# EAGLE design hw6 (EAGLE 9.6.2)
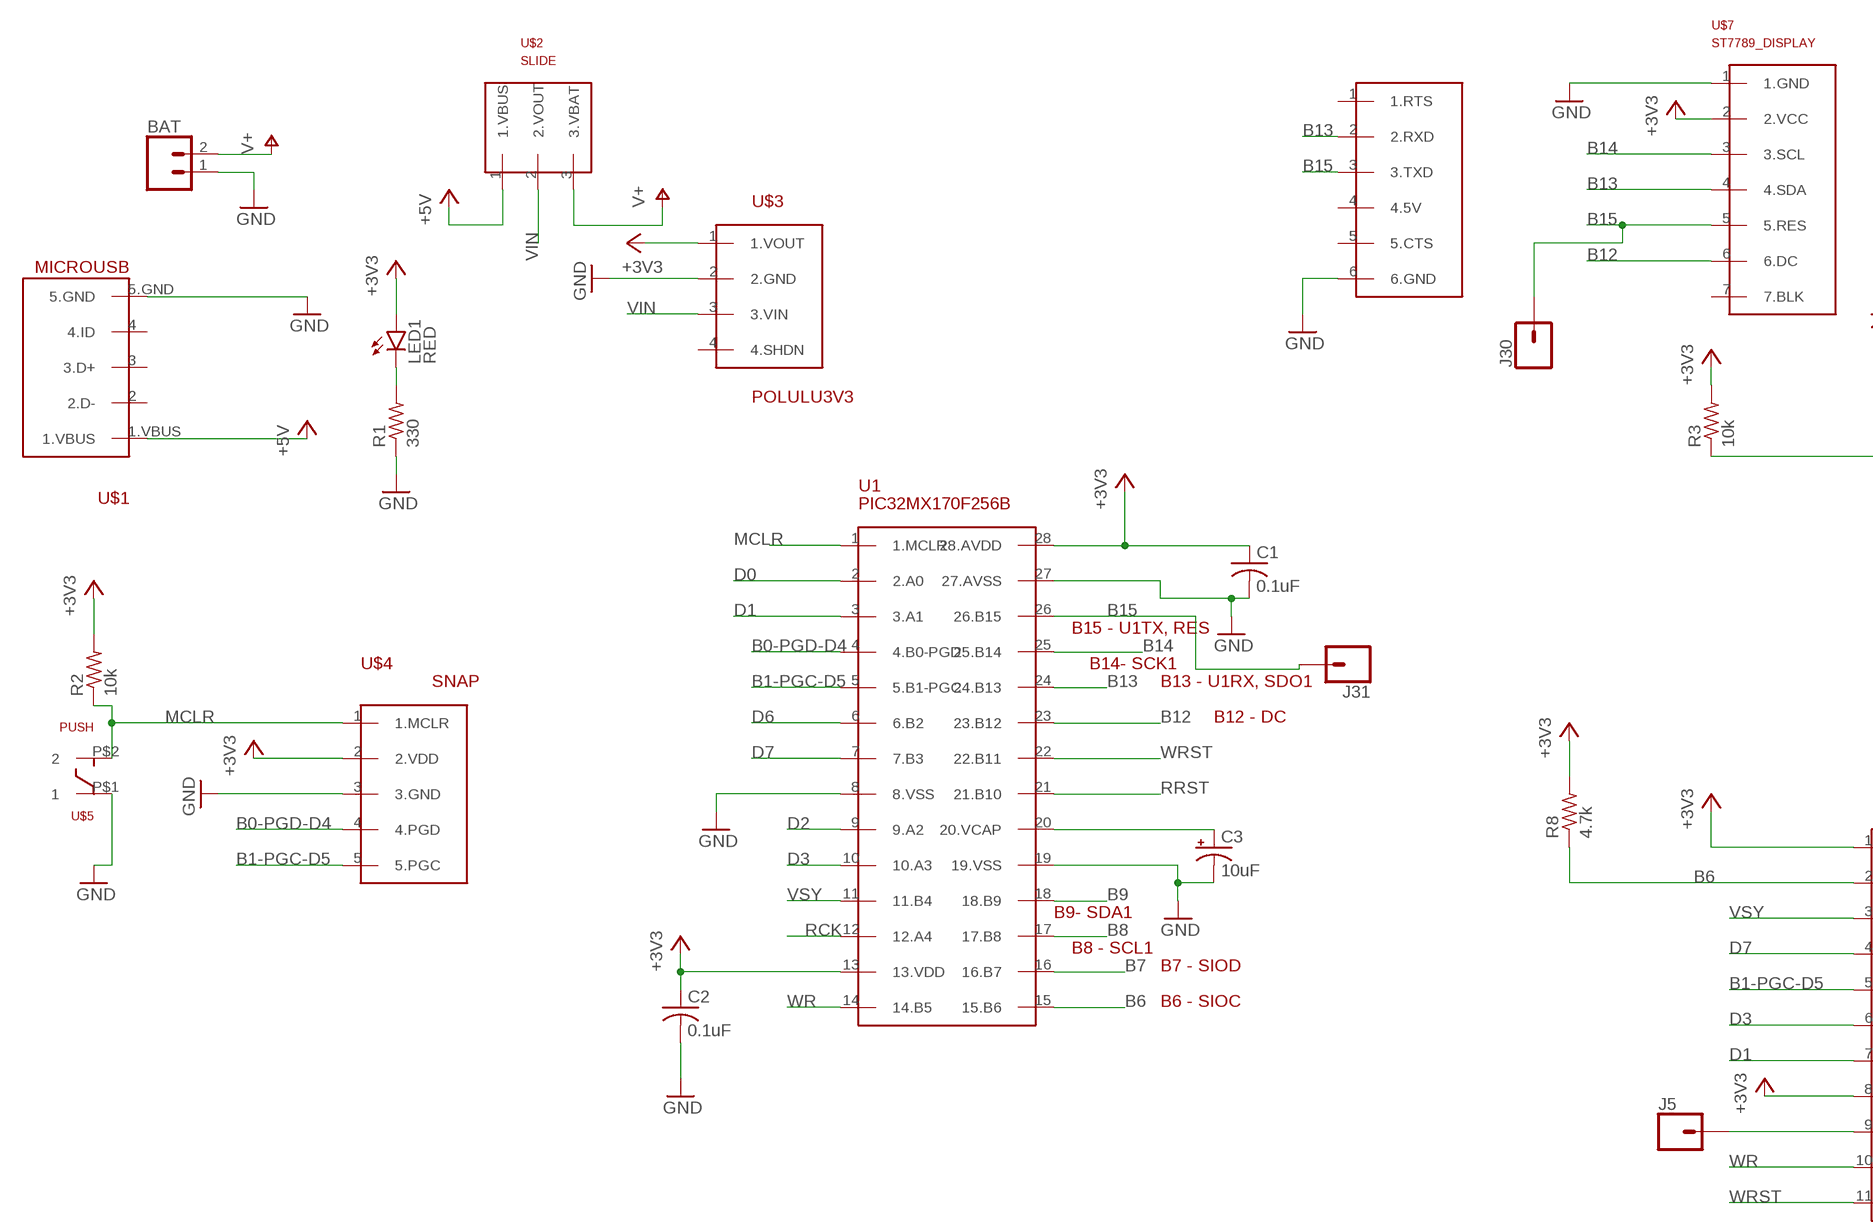
[diagram p0: schematic, sheet 1, part 1 of 2]
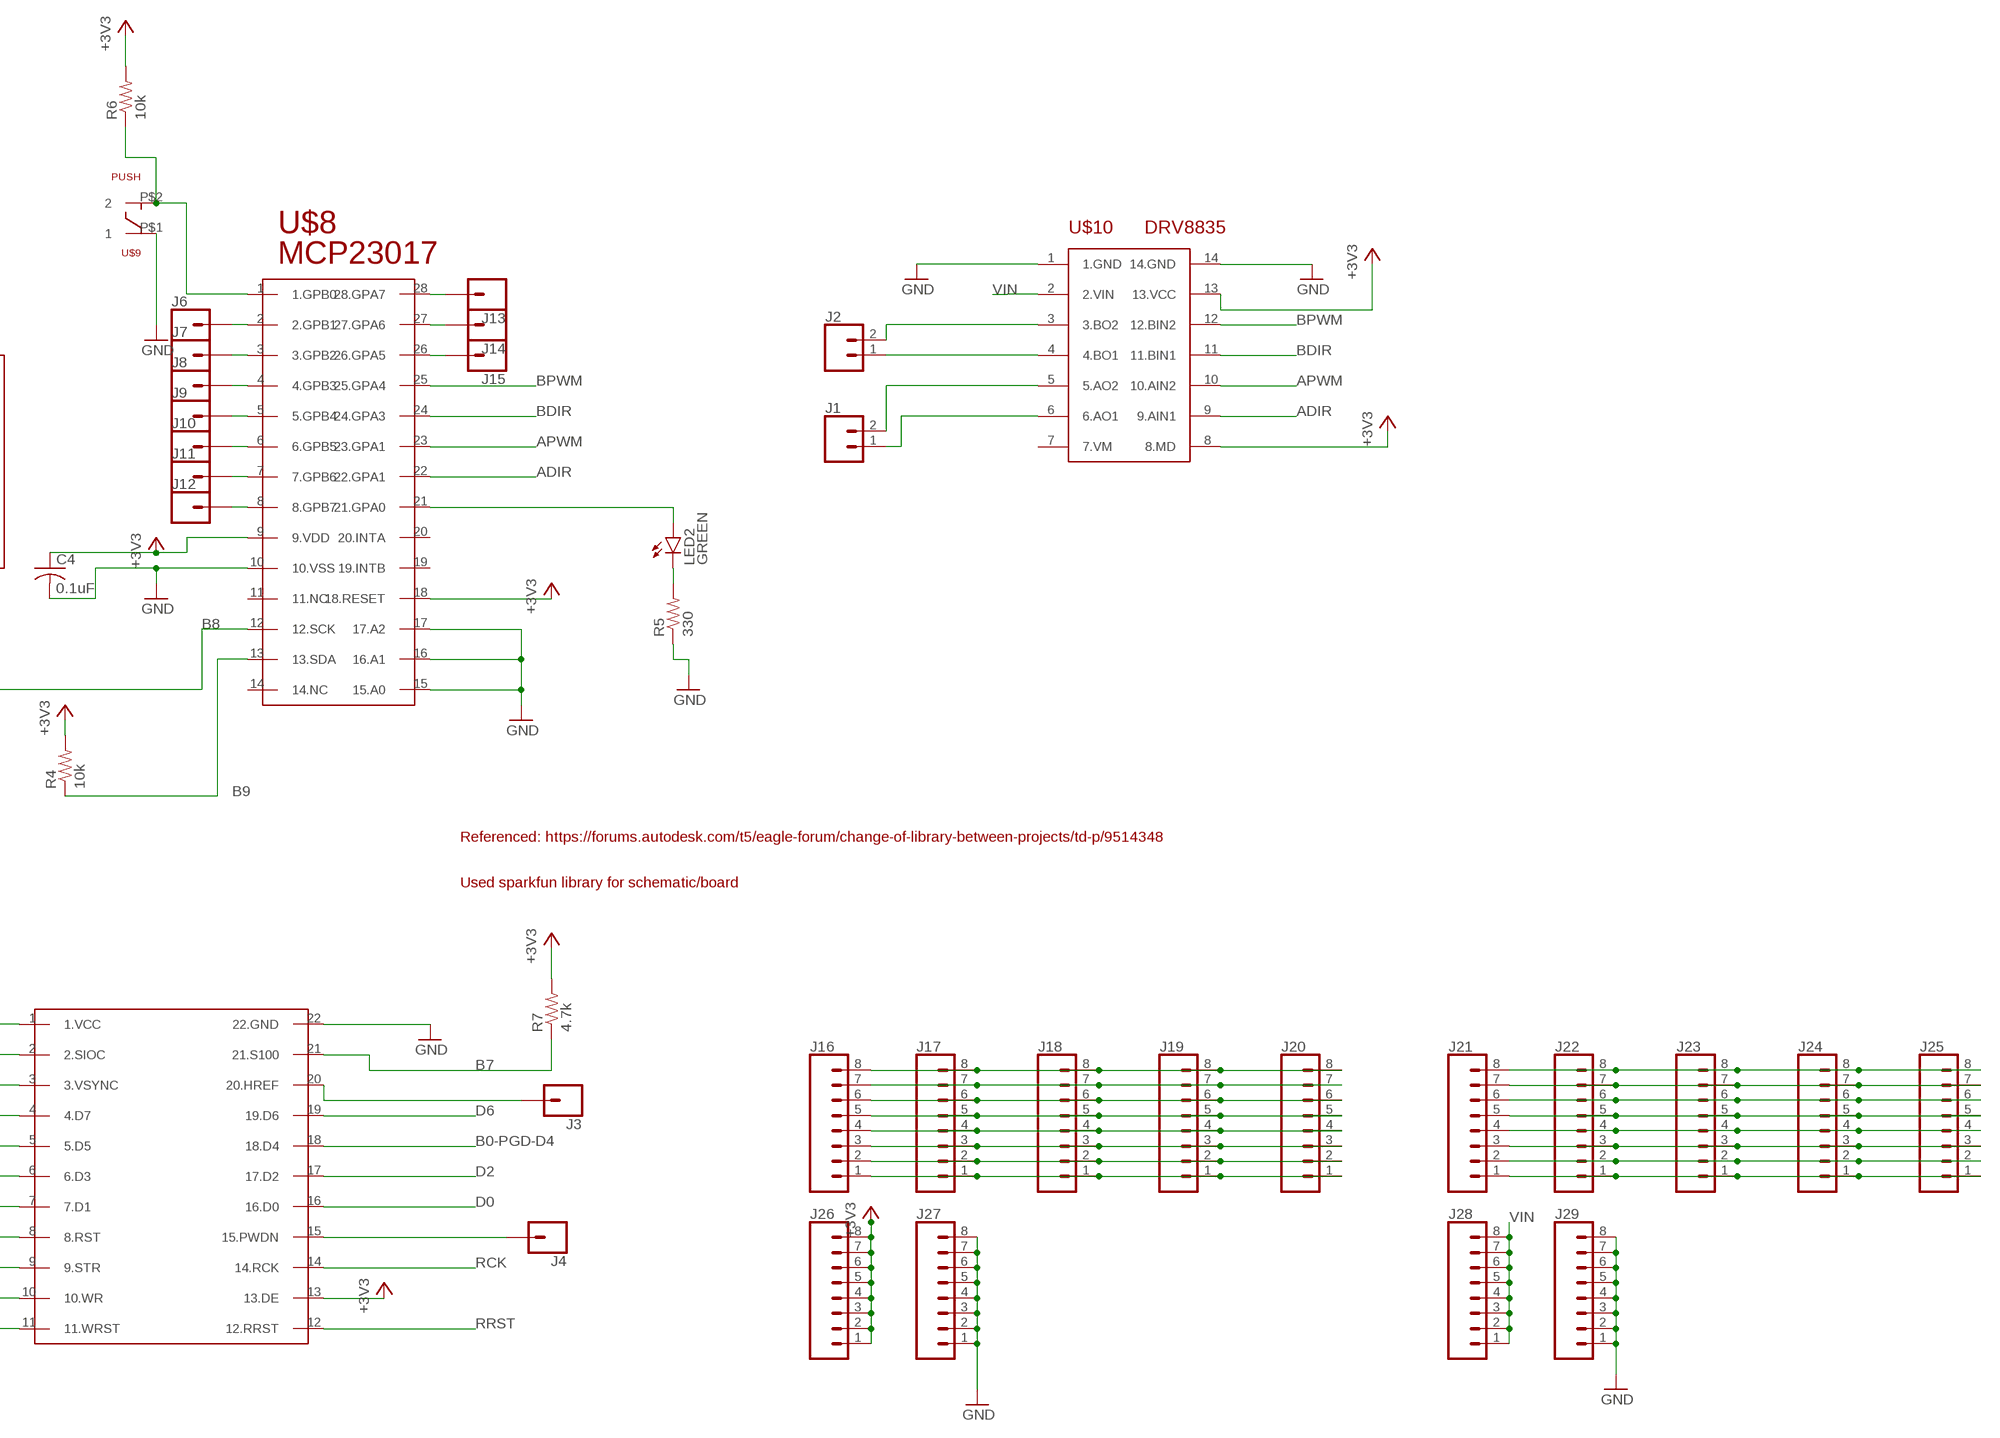
[diagram p1: schematic, sheet 1, part 2 of 2]

## Parts
BAT  CONN_02  [1X02]
C1  0.1uF  C-US025-030X050  [C025-030X050]
C2  0.1uF  C-US025-030X050  [C025-030X050]
C3  10uF  CPOL-USB45181B  [B45181B]
C4  0.1uF  C-US025-030X050  [C025-030X050]
J1  CONN_02  [1X02]
J2  CONN_02  [1X02]
J3  CONN_01  [1X01]
J4  CONN_01  [1X01]
J5  CONN_01  [1X01]
J6  CONN_01  [1X01]
J7  CONN_01  [1X01]
J8  CONN_01  [1X01]
J9  CONN_01  [1X01]
J10  CONN_01  [1X01]
J11  CONN_01  [1X01]
J12  CONN_01  [1X01]
J13  CONN_01  [1X01]
J14  CONN_01  [1X01]
J15  CONN_01  [1X01]
J16  CONN_08"  [1X08]
J17  CONN_08"  [1X08]
J18  CONN_08"  [1X08]
J19  CONN_08"  [1X08]
J20  CONN_08"  [1X08]
J21  CONN_08"  [1X08]
J22  CONN_08"  [1X08]
J23  CONN_08"  [1X08]
J24  CONN_08"  [1X08]
J25  CONN_08"  [1X08]
J26  CONN_08"  [1X08]
J27  CONN_08"  [1X08]
J28  CONN_08"  [1X08]
J29  CONN_08"  [1X08]
J30  CONN_01  [1X01]
J31  CONN_01  [1X01]
LED1  RED  LED3MM  [LED3MM]
LED2  GREEN  LED3MM  [LED3MM]
R1  330  R-US_0207/10  [0207/10]
R2  10k  R-US_0207/10  [0207/10]
R3  10k  R-US_0207/10  [0207/10]
R4  10k  R-US_0207/10  [0207/10]
R5  330  R-US_0207/10  [0207/10]
R6  10k  R-US_0207/10  [0207/10]
R7  4.7k  R-US_0207/10  [0207/10]
R8  4.7k  R-US_0207/10  [0207/10]
U1  PIC32MX170F256B  [DIL28-3]
U$1  MICROUSB  [MICROUSB1]
U$2  SLIDE  [SLIDE]
U$3  POLULU3V3  [POLULU3V3]
U$4  SNAP  [SNAP]
U$5  PUSH  [PUSH]
U$6  USB2UART  [USB2UART]
U$7  ST7789_DISPLAY  [ST7789_DISPLAY]
U$8  MCP23017  [MCP23017]
U$9  PUSH  [PUSH]
U$10  DRV8835  [DRV8835]
U$11  OV7670_CAMERA  [OV7870_CAMERA]

## Nets
+3V3: C1.1 C2.1 C4.1 J26.1 J26.2 J26.3 J26.4 J26.5 J26.6 J26.7 J26.8 LED1.A R2.2 R3.2 R4.2 R6.2 R7.2 R8.2 U1.13(13.VDD) U1.28(28.AVDD) U$3.1(1.VOUT) U$4.2(2.VDD) U$7.2(2.VCC) U$8.9(9.VDD) U$8.18(18.RESET) U$10.8(8.MD) U$10.13(13.VCC) U$11.1(1.VCC) U$11.8(8.RST) U$11.13(13.DE)
+5V: U$1.1.VBUS U$2.1(1.VBUS)
ADIR: U$8.22(22.GPA1) U$10.9(9.AIN1)
APWM: U$8.23(23.GPA1) U$10.10(10.AIN2)
B0-PGD-D4: U1.4(4.B0-PGD) U$4.4(4.PGD) U$11.18(18.D4)
B1-PGC-D5: U1.5(5.B1-PGC) U$4.5(5.PGC) U$11.5(5.D5)
B6: R8.1 U1.15(15.B6) U$11.2(2.SIOC)
B7: R7.1 U1.16(16.B7) U$11.21(21.S100)
B8: R3.1 U1.17(17.B8) U$8.12(12.SCK)
B9: R4.1 U1.18(18.B9) U$8.13(13.SDA)
B12: U1.23(23.B12) U$7.6(6.DC)
B13: U1.24(24.B13) U$6.2(2.RXD) U$7.4(4.SDA)
B14: U1.25(25.B14) U$7.3(3.SCL)
B15: J30.1 J31.1 U1.26(26.B15) U$6.3(3.TXD) U$7.5(5.RES)
BDIR: U$8.24(24.GPA3) U$10.11(11.BIN1)
BPWM: U$8.25(25.GPA4) U$10.12(12.BIN2)
D0: U1.2(2.A0) U$11.16(16.D0)
D1: U1.3(3.A1) U$11.7(7.D1)
D2: U1.9(9.A2) U$11.17(17.D2)
D3: U1.10(10.A3) U$11.6(6.D3)
D6: U1.6(6.B2) U$11.19(19.D6)
D7: U1.7(7.B3) U$11.4(4.D7)
GND: BAT.1 C1.2 C2.2 C3.- C4.2 J27.1 J27.2 J27.3 J27.4 J27.5 J27.6 J27.7 J27.8 J29.1 J29.2 J29.3 J29.4 J29.5 J29.6 J29.7 J29.8 R1.1 R5.1 U1.8(8.VSS) U1.19(19.VSS) U1.27(27.AVSS) U$1.5.GND U$3.2(2.GND) U$4.3(3.GND) U$5.P$1 U$6.6(6.GND) U$7.1(1.GND) U$8.10(10.VSS) U$8.15(15.A0) U$8.16(16.A1) U$8.17(17.A2) U$9.P$1 U$10.1(1.GND) U$10.14(14.GND) U$11.22(22.GND)
MCLR: R2.1 U1.1(1.MCLR) U$4.1(1.MCLR) U$5.P$2
N$1: LED1.K(C) R1.2
N$2: C3.+ U1.20(20.VCAP)
N$3: LED2.K(C) R5.2
N$4: R6.1 U$8.1(1.GPB0) U$9.P$2
N$5: J2.2 U$10.3(3.BO2)
N$6: LED2.A U$8.21(21.GPA0)
N$7: J2.1 U$10.4(4.BO1)
N$8: J1.2 U$10.5(5.AO2)
N$9: J1.1 U$10.6(6.AO1)
N$10: J5.1 U$11.9(9.STR)
N$11: J4.1 U$11.15(15.PWDN)
N$12: J3.1 U$11.20(20.HREF)
N$13: J6.1 U$8.2(2.GPB1)
N$14: J7.1 U$8.3(3.GPB2)
N$15: J8.1 U$8.4(4.GPB3)
N$16: J9.1 U$8.5(5.GPB4)
N$17: J10.1 U$8.6(6.GPB5)
N$18: J11.1 U$8.7(7.GPB6)
N$19: J12.1 U$8.8(8.GPB7)
N$20: J15.1 U$8.26(26.GPA5)
N$21: J14.1 U$8.27(27.GPA6)
N$22: J13.1 U$8.28(28.GPA7)
N$23: J16.8 J17.8 J18.8 J19.8 J20.8
N$24: J16.7 J17.7 J18.7 J19.7 J20.7
N$25: J16.6 J17.6 J18.6 J19.6 J20.6
N$26: J16.5 J17.5 J18.5 J19.5 J20.5
N$27: J16.4 J17.4 J18.4 J19.4 J20.4
N$28: J16.3 J17.3 J18.3 J19.3 J20.3
N$29: J16.2 J17.2 J18.2 J19.2 J20.2
N$30: J16.1 J17.1 J18.1 J19.1 J20.1
N$31: J21.1 J22.1 J23.1 J24.1 J25.1
N$32: J21.2 J22.2 J23.2 J24.2 J25.2
N$33: J21.3 J22.3 J23.3 J24.3 J25.3
N$34: J21.4 J22.4 J23.4 J24.4 J25.4
N$35: J21.5 J22.5 J23.5 J24.5 J25.5
N$36: J21.6 J22.6 J23.6 J24.6 J25.6
N$37: J21.7 J22.7 J23.7 J24.7 J25.7
N$38: J21.8 J22.8 J23.8 J24.8 J25.8
RCK: U1.12(12.A4) U$11.14(14.RCK)
RRST: U1.21(21.B10) U$11.12(12.RRST)
V+: BAT.2 U$2.3(3.VBAT)
VIN: J28.1 J28.2 J28.3 J28.4 J28.5 J28.6 J28.7 J28.8 U$2.2(2.VOUT) U$3.3(3.VIN) U$10.2(2.VIN)
VSY: U1.11(11.B4) U$11.3(3.VSYNC)
WR: U1.14(14.B5) U$11.10(10.WR)
WRST: U1.22(22.B11) U$11.11(11.WRST)
Unconnected: U$1.2(2.D-) U$1.3(3.D+) U$1.4(4.ID) U$3.4(4.SHDN) U$6.1(1.RTS) U$6.4(4.5V) U$6.5(5.CTS) U$7.7(7.BLK) U$8.11(11.NC) U$8.14(14.NC) U$8.19(19.INTB) U$8.20(20.INTA) U$10.7(7.VM)

## Notes on the sheet
- B15 - U1TX, RES | Referenced: https://forums.autodesk.com/t5/eagle-forum/change-of-library-between-projects/td-p/9514348
- B14- SCK1
- B13 - U1RX, SDO1 | Used sparkfun library for schematic/board
- B12 - DC
- B9- SDA1
- B8 - SCL1
- B7 - SIOD
- B6 - SIOC

## Library data of the parts
BAT J1 J2 = hw6library_Ian:CONN_02: Multi connection point. Often used as Generic Header-pin footprint for 0.1 inch spaced/style header connections On any of the 0.1 inch spaced packages, you can populate with these: Break Away Headers - Straight <https://www.sparkfun.com/products/116> (PRT-00116) Break Away Male Headers - Right Angle <https://www.sparkfun.com/products/553> (PRT-00553) Female Headers <https://www.sparkfun.com/products/115> (PRT-00115) Break Away Headers - Machine Pin <https://www.sparkfun.com/products/117> (PRT-00117) Break Away Female Headers - Swiss Machine Pin <https://www.sparkfun.com/products/743> (PRT-00743) For SCREWTERMINALS and SPRING TERMINALS visit here: Screw Terimnals on SparkFun.com <https://www.sparkfun.com/search/results?term=Screw+Terminals> (5mm/3.5mm/2.54mm spacing) This device is also useful as a general connection point to wire up your design to another part of your project. Our various solder wires solder well into these plated through hole pads. Hook-Up Wire - Assortment (Stranded, 22 AWG) <https://www.sparkfun.com/products/11375> (PRT-11375) Hook-Up Wire - Assortment (Solid Core, 22 AWG) <https://www.sparkfun.com/products/11367> (PRT-11367) View the entire wire category on our website here <https://www.sparkfun.com/categories/141> Special notes: Molex polarized connector foot print use with: PRT-08233 with associated crimp pins and housings. 2.54_SCREWTERM for use with PRT-10571. 3.5mm Screw Terminal footprints for PRT-08084 5mm Screw Terminal footprints for use with PRT-08432
C1 C2 C4 = hw6library_Ian:C-US: CAPACITOR, American symbol; SPICEPREFIX: C
C3 = hw6library_Ian:CPOL-US: POLARIZED CAPACITOR, American symbol; SPICEPREFIX: C
J3-J15 J30 J31 = hw6library_Ian:CONN_01: Single connection point. Often used as Generic Header-pin footprint for 0.1 inch spaced/style header connections On any of the 0.1 inch spaced packages, you can populate with these: Break Away Headers - Straight <https://www.sparkfun.com/products/116> (PRT-00116) Break Away Male Headers - Right Angle <https://www.sparkfun.com/products/553> (PRT-00553) Female Headers <https://www.sparkfun.com/products/115> (PRT-00115) Break Away Headers - Machine Pin <https://www.sparkfun.com/products/117> (PRT-00117) Break Away Female Headers - Swiss Machine Pin <https://www.sparkfun.com/products/743> (PRT-00743) This device is also useful as a general connection point to wire up your design to another part of your project. Our various solder wires solder well into these plated through hole pads. Hook-Up Wire - Assortment (Stranded, 22 AWG) <https://www.sparkfun.com/products/11375> (PRT-11375) Hook-Up Wire - Assortment (Solid Core, 22 AWG) <https://www.sparkfun.com/products/11367> (PRT-11367) View the entire wire category on our website here <https://www.sparkfun.com/categories/141> Special notes: SMTSO-256-ET is a "flush mount" nut for a 4-40 screw. We mostly use this on specialty testbeds; it is a nice way to connect hardware to your PCB at an adjustable hieght. Also note, the SNAP packages are for using a snappable style connector. We sell a baggie of snaps and they are also used on two LilyPad designs: Snap Assortment - 30 pack (male and female) <https://www.sparkfun.com/products/11347> (DEV-11347) LilyPad Arduino SimpleSnap <https://www.sparkfun.com/products/10941> (DEV-10941) LilyPad SimpleSnap Protoboard <https://www.sparkfun.com/products/10940> (DEV-10940)
J16-J29 = hw6library_Ian:CONN_08: Multi connection point. Often used as Generic Header-pin footprint for 0.1 inch spaced/style header connections On any of the 0.1 inch spaced packages, you can populate with these: Break Away Headers - Straight <https://www.sparkfun.com/products/116> (PRT-00116) Break Away Male Headers - Right Angle <https://www.sparkfun.com/products/553> (PRT-00553) Female Headers <https://www.sparkfun.com/products/115> (PRT-00115) Break Away Headers - Machine Pin <https://www.sparkfun.com/products/117> (PRT-00117) Break Away Female Headers - Swiss Machine Pin <https://www.sparkfun.com/products/743> (PRT-00743) Arduino Stackable Header - 8 Pin <https://www.sparkfun.com/products/9279> (PRT-09279) For SCREWTERMINALS and SPRING TERMINALS visit here: Screw Terimnals on SparkFun.com <https://www.sparkfun.com/search/results?term=Screw+Terminals> (5mm/3.5mm/2.54mm spacing) This device is also useful as a general connection point to wire up your design to another part of your project. Our various solder wires solder well into these plated through hole pads. Hook-Up Wire - Assortment (Stranded, 22 AWG) <https://www.sparkfun.com/products/11375> (PRT-11375) Hook-Up Wire - Assortment (Solid Core, 22 AWG) <https://www.sparkfun.com/products/11367> (PRT-11367) View the entire wire category on our website here <https://www.sparkfun.com/categories/141> Special notes: Molex polarized connector foot print use with SKU : PRT-08231 with associated crimp pins and housings. 1MM SMD Version SKU: PRT-10208 NOTES ON THE VARIANTS LOCK and LOCK_LONGPADS... This footprint was designed to help hold the alignment of a through-hole component (i.e. 6-pin header) while soldering it into place. You may notice that each hole has been shifted either up or down by 0.005 of an inch from it's more standard position (which is a perfectly straight line). This slight alteration caused the pins (the squares in the middle) to touch the edges of the holes. Because they are alternating, it causes a "brace" to hold the component in place. 0.005 has proven to be the perfect amount of "off-center" position when using our standard breakaway headers. Although looks a little odd when you look at the bare footprint, once you have a header in there, the alteration is very hard to notice. Also,if you push a header all the way into place, it is covered up entirely on the bottom side.; PROD_ID: CONN-08438
LED1 LED2 = hw6library_Ian:LED: LED OSRAM: - CHIPLED LG R971, LG N971, LY N971, LG Q971, LY Q971, LO R971, LY R971 LH N974, LH R974 LS Q976, LO Q976, LY Q976 LO Q996 - Hyper CHIPLED LW Q18S LB Q993, LB Q99A, LB R99A - SideLED LS A670, LO A670, LY A670, LG A670, LP A670 LB A673, LV A673, LT A673, LW A673 LH A674 LY A675 LS A676, LA A676, LO A676, LY A676, LW A676 LS A679, LY A679, LG A679 - Hyper Micro SIDELED® LS Y876, LA Y876, LO Y876, LY Y876 LT Y87S - SmartLED LW L88C, LW L88S LB L89C, LB L89S, LG L890 LS L89K, LO L89K, LY L89K LS L896, LA L896, LO L896, LY L896 - TOPLED LS T670, LO T670, LY T670, LG T670, LP T670 LSG T670, LSP T670, LSY T670, LOP T670, LYG T670 LG T671, LOG T671, LSG T671 LB T673, LV T673, LT T673, LW T673 LH T674 LS T676, LA T676, LO T676, LY T676, LB T676, LH T676, LSB T676, LW T676 LB T67C, LV T67C, LT T67C, LS T67K, LO T67K, LY T67K, LW E67C LS E67B, LA E67B, LO E67B, LY E67B, LB E67C, LV E67C, LT E67C LW T67C LS T679, LY T679, LG T679 LS T770, LO T770, LY T770, LG T770, LP T770 LB T773, LV T773, LT T773, LW T773 LH T774 LS E675, LA E675, LY E675, LS T675 LS T776, LA T776, LO T776, LY T776, LB T776 LHGB T686 LT T68C, LB T68C - Hyper Mini TOPLED® LB M676 - Mini TOPLED Santana® LG M470 LS M47K, LO M47K, LY M47K Source: http://www.osram.convergy.de LUXEON: - LUMILED® LXK2-PW12-R00, LXK2-PW12-S00, LXK2-PW14-U00, LXK2-PW14-V00 LXK2-PM12-R00, LXK2-PM12-S00, LXK2-PM14-U00 LXK2-PE12-Q00, LXK2-PE12-R00, LXK2-PE12-S00, LXK2-PE14-T00, LXK2-PE14-U00 LXK2-PB12-K00, LXK2-PB12-L00, LXK2-PB12-M00, LXK2-PB14-N00, LXK2-PB14-P00, LXK2-PB14-Q00 LXK2-PR12-L00, LXK2-PR12-M00, LXK2-PR14-Q00, LXK2-PR14-R00 LXK2-PD12-Q00, LXK2-PD12-R00, LXK2-PD12-S00 LXK2-PH12-R00, LXK2-PH12-S00 LXK2-PL12-P00, LXK2-PL12-Q00, LXK2-PL12-R00 Source: www.luxeon.com KINGBRIGHT: KA-3528ASYC Source: www.kingbright.com
R1-R8 = hw6library_Ian:R-US_: RESISTOR, American symbol; SPICEPREFIX: R
U1 = hw6library_Ian:PIC32MX170F256B
U$1 = hw6library_Ian:MICROUSB
U$2 = hw6library_Ian:SLIDE
U$3 = hw6library_Ian:POLULU3V3
U$4 = hw6library_Ian:SNAP
U$5 U$9 = hw6library_Ian:PUSH
U$6 = hw6library_Ian:USB2UART
U$7 = hw6library_Ian:ST7789_DISPLAY
U$8 = hw6library_Ian:MCP23017
U$10 = hw6library_Ian:DRV8835
U$11 = hw6library_Ian:OV7670_CAMERA

## Board
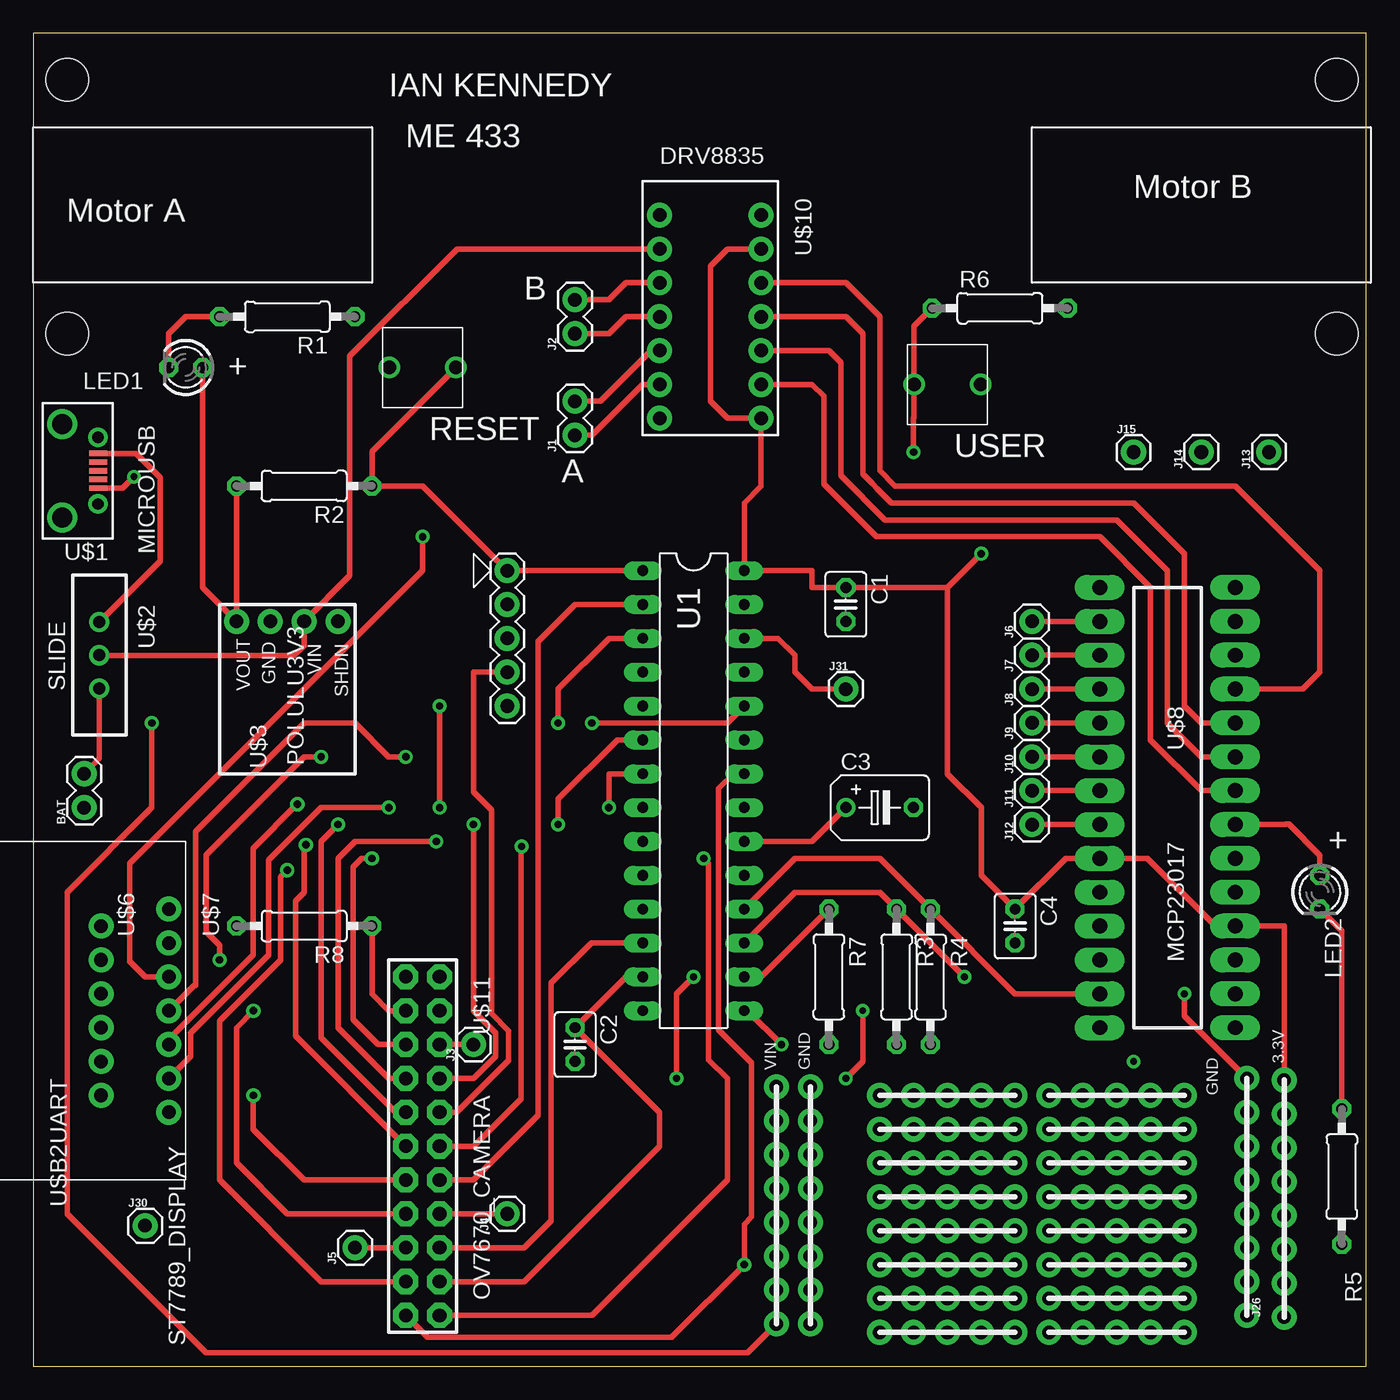
[diagram p2: board, top side]
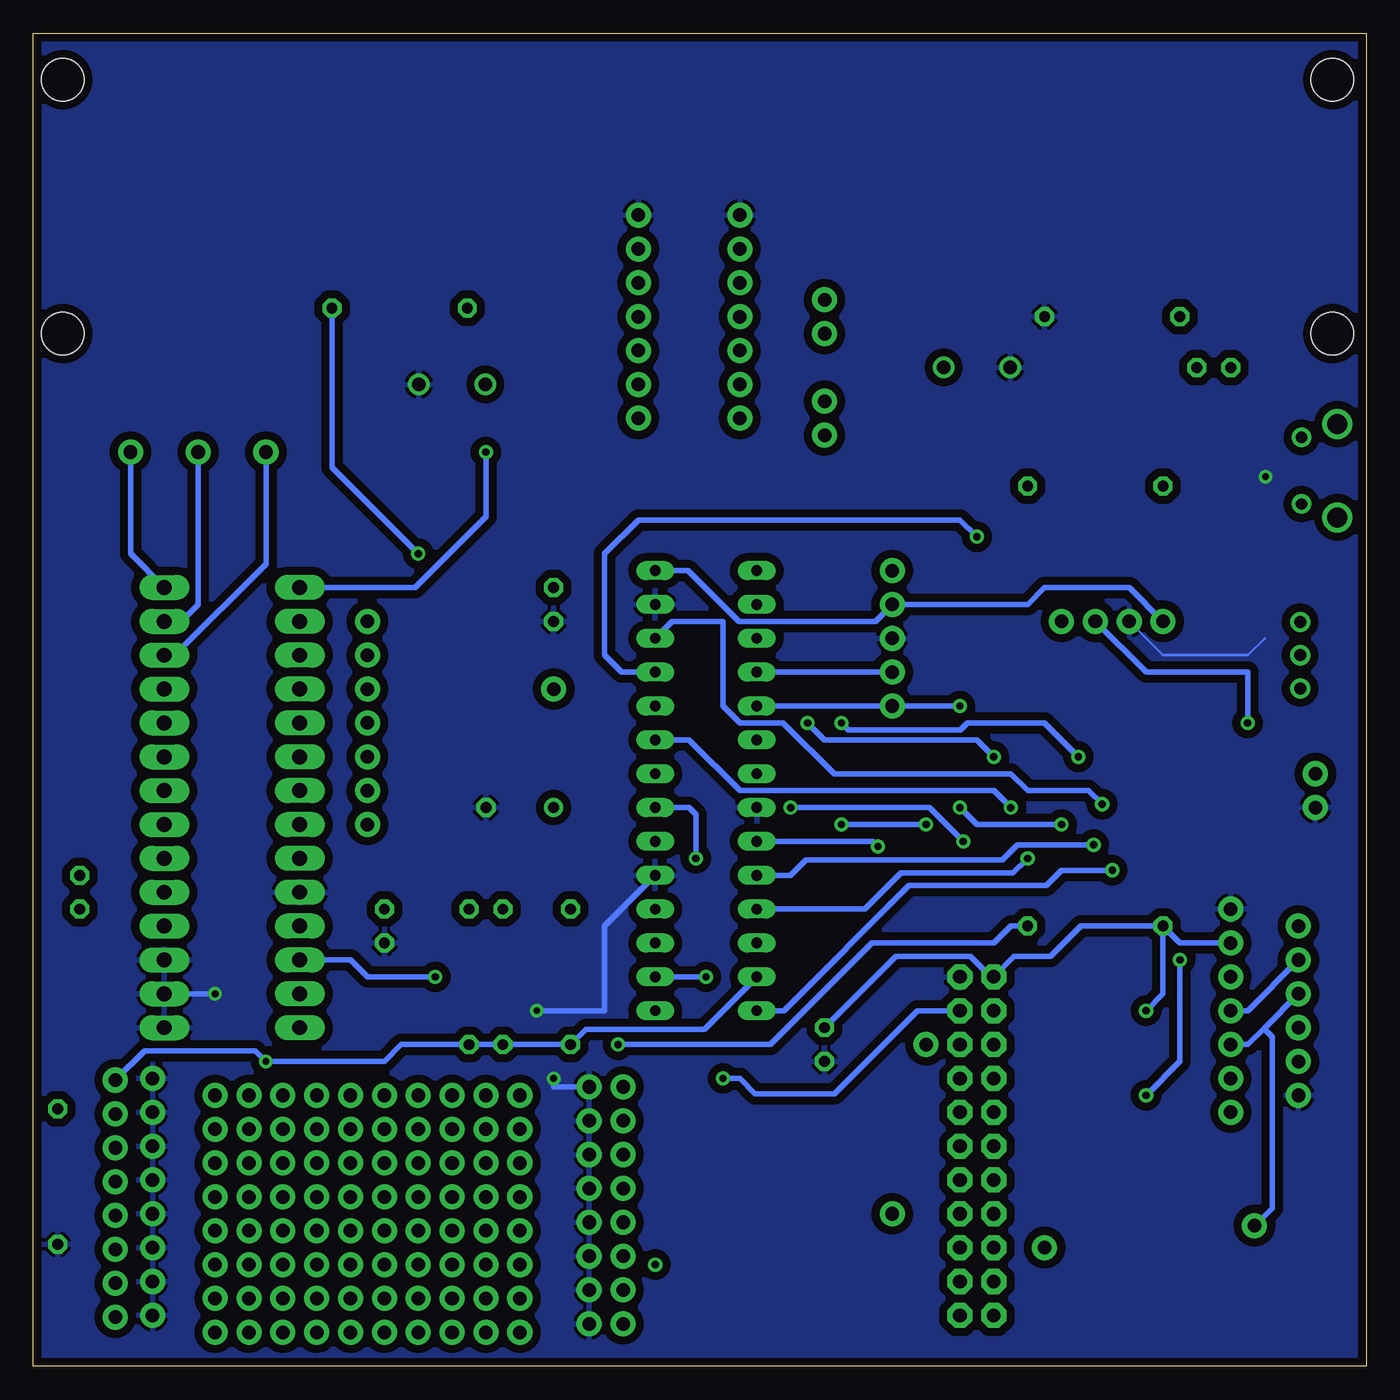
[diagram p3: board, bottom side, seen from below]

Size 100 x 100 mm. Coordinates in mm from the lower left corner, seen from the top.
Outline: 0,0 100,0 100,100 0,100 0,0
Copper layers (1*16): Top 0.035mm / dielectric 1.5mm / Bottom 0.035mm
Design rules "SparkFun": minimum track width 8mil, minimum drill 20mil, track to track 8mil, track to pad 8mil, pad to pad 8mil, via to via 8mil, smd to smd 8mil, copper to edge 8mil, drill to drill 8mil, minimum pad ring 12mil, minimum via ring 10mil, stop-mask expansion 4mil, vias tented up to drill 20mil, thermal gap 10mil
Holes 3.17 mm at 2.54,96.52 2.54,77.47 97.79,77.47 97.79,96.52

### Footprints (pad centres in the part's own frame; a part is rotated, then mirrored left to right if it is on the bottom)
1X02 = drill 1.016 pad 1.88: 1 0,0; 2 2.54,0
C025-030X050 = drill 0.813 octagon: 1 -1.27,0; 2 1.27,0
B45181B = drill 0.813: + -2.54,0 | drill 0.813 octagon: - 2.54,0
1X01 = drill 1.016 pad 1.88: 1 0,0
1X08 = drill 1.016 pad 1.88: 1 0,0; 2 2.54,0; 3 5.08,0; 4 7.62,0; 5 10.16,0; 6 12.7,0; 7 15.24,0; 8 17.78,0
LED3MM = drill 0.813 octagon: A -1.27,0; K 1.27,0
0207/10 = drill 0.813 octagon: 1 -5.08,0; 2 5.08,0
DIL28-3 = drill 0.813 long: 1 -16.51,-3.81; 2 -13.97,-3.81; 3 -11.43,-3.81; 4 -8.89,-3.81; 5 -6.35,-3.81; 6 -3.81,-3.81; 7 -1.27,-3.81; 8 1.27,-3.81; 9 3.81,-3.81; 10 6.35,-3.81; 11 8.89,-3.81; 12 11.43,-3.81; 13 13.97,-3.81; 14 16.51,-3.81; 15 16.51,3.81; 16 13.97,3.81; 17 11.43,3.81; 18 8.89,3.81; 19 6.35,3.81; 20 3.81,3.81; 21 1.27,3.81; 22 -1.27,3.81; 23 -3.81,3.81; 24 -6.35,3.81; 25 -8.89,3.81; 26 -11.43,3.81; 27 -13.97,3.81; 28 -16.51,3.81
MICROUSB1 = smd 0.4 x 1.35: 1.VBUS -1.3,1.43; 2 -0.65,1.43; 3 0,1.43; 4 0.65,1.43; 5.GND 1.3,1.43 | drill 0.85: P$1 2.5,1.43; P$6 -2.5,1.43 | drill 1.5: P$8 -3.5,-1.27; P$9 3.5,-1.27
SLIDE = drill 0.9: 1 -2.5,0; 2 0,0; 3 2.5,0
POLULU3V3 = drill 1.016 pad 1.88: 1 0,3.81; 2 0,1.27; 3 0,-1.27; 4 0,-3.81
SNAP = drill 1.016 pad 1.88: 1 -5.08,0; 2 -2.54,0; 3 0,0; 4 2.54,0; 5 5.08,0
PUSH = drill 1: P$1 -2.5,0; P$2 2.5,0
USB2UART = drill 1.016 pad 1.88: 1 -6.35,0; 2 -3.81,0; 3 -1.27,0; 4 1.27,0; 5 3.81,0; 6 6.35,0
ST7789_DISPLAY = drill 1.016 pad 1.88: 1 -7.62,0; 2 -5.08,0; 3 -2.54,0; 4 0,0; 5 2.54,0; 6 5.08,0; 7 7.62,0
MCP23017 = drill 1.118 pad 1.88 long: 1 -16.51,-5.08; 2 -13.97,-5.08; 3 -11.43,-5.08; 4 -8.89,-5.08; 5 -6.35,-5.08; 6 -3.81,-5.08; 7 -1.27,-5.08; 8 1.27,-5.08; 9 3.81,-5.08; 10 6.35,-5.08; 11 8.89,-5.08; 12 11.43,-5.08; 13 13.97,-5.08; 14 16.51,-5.08; 15 16.51,5.08; 16 13.97,5.08; 17 11.43,5.08; 18 8.89,5.08; 19 6.35,5.08; 20 3.81,5.08; 21 1.27,5.08; 22 -1.27,5.08; 23 -3.81,5.08; 24 -6.35,5.08; 25 -8.89,5.08; 26 -11.43,5.08; 27 -13.97,5.08; 28 -16.51,5.08
DRV8835 = drill 1.016 pad 1.88: 1 -7.62,-3.81; 2 -5.08,-3.81; 3 -2.54,-3.81; 4 0,-3.81; 5 2.54,-3.81; 6 5.08,-3.81; 7 7.62,-3.81; 8 7.62,3.81; 9 5.08,3.81; 10 2.54,3.81; 11 0,3.81; 12 -2.54,3.81; 13 -5.08,3.81; 14 -7.62,3.81
OV7870_CAMERA = drill 1.016 pad 1.88 octagon: 1 -12.7,-1.27; 2 -10.16,-1.27; 3 -7.62,-1.27; 4 -5.08,-1.27; 5 -2.54,-1.27; 6 0,-1.27; 7 2.54,-1.27; 8 5.08,-1.27; 9 7.62,-1.27; 10 10.16,-1.27; 11 12.7,-1.27; 12 12.7,1.27; 13 10.16,1.27; 14 7.62,1.27; 15 5.08,1.27; 16 2.54,1.27; 17 0,1.27; 18 -2.54,1.27; 19 -5.08,1.27; 20 -7.62,1.27; 21 -10.16,1.27; 22 -12.7,1.27

### Placement (x,y rotation side)
BAT  3.81,41.91 90 top
C1  60.96,57.15 270 top
C2  40.64,24.13 270 top
C3  63.5,41.91 0 top
C4  73.66,33.02 270 top
J1  40.64,69.85 90 top
J2  40.64,77.47 90 top
J3  33.02,24.13 90 top
J4  35.56,11.43 90 top
J5  24.13,8.89 90 top
J6  74.93,55.88 90 top
J7  74.93,53.34 90 top
J8  74.93,50.8 90 top
J9  74.93,48.26 90 top
J10  74.93,45.72 90 top
J11  74.93,43.18 90 top
J12  74.93,40.64 90 top
J13  92.71,68.58 90 top
J14  87.63,68.58 90 top
J15  82.55,68.58 0 top
J16  63.5,20.32 270 top
J17  66.04,20.32 270 top
J18  68.58,20.32 270 top
J19  71.12,20.32 270 top
J20  73.66,20.32 270 top
J21  76.2,20.32 270 top
J22  78.74,20.32 270 top
J23  81.28,20.32 270 top
J24  83.82,20.32 270 top
J25  86.36,20.32 270 top
J26  93.85,3.68 90 top
J27  91.06,21.59 270 top
J28  55.75,20.95 270 top
J29  58.29,20.95 270 top
J30  8.38,10.54 0 top
J31  60.96,50.8 0 top
LED1  11.43,74.93 180 top
LED2  96.52,35.56 270 top
R1  19.05,78.74 180 top
R2  20.32,66.04 180 top
R3  64.77,29.21 270 top
R4  67.31,29.21 270 top
R5  98.17,14.22 90 top
R6  72.52,79.38 0 top
R7  59.69,29.21 270 top
R8  20.32,33.02 180 top
U1  49.53,43.18 270 top
U$1  3.43,67.18 270 top
U$2  4.95,53.34 270 top
U$3  19.05,55.88 90 top
U$4  35.56,54.61 270 top
U$5  29.21,74.93 0 top
U$6  5.08,26.67 270 top
U$7  10.16,26.67 270 top
U$8  85.09,41.91 270 top
U$9  68.58,73.66 180 top
U$10  50.8,78.74 270 top
U$11  29.21,16.51 270 top

### Tracks (layer width: path | path; a pad name or v marks a point on that pad's centre or on a via)
+3V3  (via drill 0.51, 0.55, 0.55 pad 0.55)
  Top 0.406: LED1.A 12.7,58.42 U$3.1 R2.2 | 68.58,58.42 68.58,44.45 71.12,41.91 71.12,36.83 C4.1 77.47,38.1 U$8.9 83.59,38.1 88.67,33.02 U$8.18 93.85,33.02 J26.8 J26.7 J26.6 J26.5 J26.4 J26.3 J26.2 J26.1 | 68.58,58.42 v71.12,60.96 | 68.58,58.42 C1.1 58.42,58.42 58.42,59.69 U1.28 53.34,64.77 54.61,66.04 U$10.8 52.07,71.12 50.8,72.39 50.8,82.55 52.07,83.82 U$10.13 | U$11.13 36.83,6.35 46.99,16.51 46.99,19.05 C2.1 44.45,29.21 U1.13 | U$11.8 19.05,11.43 15.24,15.24 15.24,25.4 v16.51,26.67
  Bottom 0.406: U$7.2 13.97,31.75 R8.2 | R8.2 21.42,33.02 23.71,30.73 26.42,30.73 U$11.1 28.14,29.21 29.69,30.76 35.28,30.76 C2.1 | U$3.1 17.78,58.42 24.13,58.42 25.4,57.15 U$4.2 36.83,55.88 47.05,55.88 50.87,59.69 U1.28 | v71.12,60.96 77.6,67.44 R6.2 | U1.13 49.66,25.27 58.55,25.27 R7.2 R3.2 R4.2 72.39,24.13 73.66,22.86 v82.55,22.86 83.36,23.67 91.64,23.67 J26.8 | v16.51,26.67 15.24,27.94 R8.2
+5V
  Top 0.406: U$2.1 9.53,60.41 9.53,66.67 7.72,68.48 U$1.1.VBUS
ADIR
  Top 0.406: U$8.22 87.63,43.18 83.82,46.99 83.82,58.42 80.01,62.23 63.25,62.23 59.31,66.17 59.31,72.77 58.42,73.66 U$10.9
APWM
  Top 0.406: U$8.23 87.63,45.72 85.09,48.26 85.09,59.69 81.28,63.5 63.88,63.5 60.58,66.8 60.58,75.31 59.69,76.2 U$10.10
B0-PGD-D4
  Top 0.406: U$11.18 31.75,19.05 35.66,22.96 35.66,25.17 34.36,26.47 34.36,41.75 33.02,43.09 33.02,52.07 U$4.4
  Bottom 0.406: U$4.4 U1.4
B1-PGC-D5  (via drill 0.55)
  Top 0.406: U$11.5 27.18,19.05 21.59,24.64 21.59,39.37 v22.86,40.64 | v30.48,41.91 v30.48,49.53
  Bottom 0.406: U1.5 U$4.5 v30.48,49.53 | v22.86,40.64 29.21,40.64 v30.48,41.91
B6  (via drill 0.55)
  Top 0.406: R8.1 25.4,27.94 26.67,26.67 U$11.2 | v56.13,24.13 53.59,26.67 U1.15
  Bottom 0.406: R8.1 26.67,33.02 27.94,31.75 37.08,31.75 44.7,24.13 v56.13,24.13
B7  (via drill 0.55)
  Top 0.406: R7.1 54.61,29.21 U1.16 | v49.53,29.21 48.26,27.94 v48.26,21.59
  Bottom 0.406: U$11.21 33.66,26.67 39.88,20.45 45.85,20.45 46.99,21.59 v48.26,21.59 | v49.53,29.21 U1.16
B8  (via drill 0.55)
  Top 0.406: U1.17 57.15,35.56 63.5,35.56 R3.1 v69.85,29.21
  Bottom 0.406: v69.85,29.21 74.93,29.21 76.2,30.48 U$8.12
B9
  Top 0.406: U1.18 57.15,38.1 63.5,38.1 R4.1 73.66,27.94 U$8.13
B12  (via drill 0.55)
  Top 0.406: U$7.6 11.81,23.24 11.81,25.02 17.65,30.86 17.65,37.97 21.59,41.91 v26.67,41.91
  Bottom 0.406: v26.67,41.91 27.94,43.18 46.99,43.18 50.8,46.99 U1.23
B13  (via drill 0.55)
  Top 0.406: U$7.4 12.06,28.57 12.19,28.57 12.19,40.13 20.32,48.26 24.13,48.26 26.67,45.72 v27.94,45.72 | U1.24 52.07,48.26 v41.91,48.26
  Bottom 0.406: v27.94,45.72 29.21,46.99 40.64,46.99 v41.91,48.26 | U$7.4 8.89,26.67 U$6.2
B14  (via drill 0.55 pad 0.55)
  Top 0.406: U$7.3 8.38,29.21 7.24,30.35 7.24,37.72 29.21,59.69 v29.21,62.23
  Bottom 0.406: v29.21,62.23 30.48,63.5 54.61,63.5 57.15,60.96 57.15,53.34 55.88,52.07 U1.25
B15  (via drill 0.55)
  Top 0.406: U$7.5 10.16,24.51 16.51,30.86 16.51,38.86 v19.81,42.16 | U1.26 55.88,54.61 57.15,53.34 57.15,52.07 58.42,50.8 J31.1
  Bottom 0.406: v19.81,42.16 20.83,43.18 25.4,43.18 26.64,44.42 39.91,44.42 43.74,48.26 46.99,48.26 48.26,49.53 48.26,55.88 52.07,55.88 U1.26 | U$7.5 8.89,24.13 7.62,25.4 | 7.62,25.4 U$6.3 | 7.62,25.4 7.62,25.27 7.06,24.71 7.06,11.86 J30.1
BDIR
  Top 0.406: U$8.24 87.63,48.26 86.36,49.53 86.36,60.96 82.55,64.77 64.39,64.77 63.31,65.85 62.94,66.22 62.23,66.93 62.23,77.47 60.96,78.74 U$10.11
BPWM
  Top 0.406: U$8.25 95.25,50.8 96.52,52.07 96.52,59.69 90.17,66.04 64.64,66.04 63.5,67.18 63.5,78.74 60.96,81.28 U$10.12
D0
  Top 0.406: U1.2 40.64,57.15 37.87,54.38 37.87,18.82 33.02,13.97 U$11.16
D1  (via drill 0.55, 0.55 pad 0.55)
  Top 0.406: U$11.7 20.32,13.97 16.51,17.78 v16.51,20.32 | v13.97,30.48 13.97,31.58 12.95,32.6 12.95,38.35 20.32,45.72 v21.59,45.72 | v39.37,48.26 39.37,50.8 43.18,54.61 U1.3
  Bottom 0.406: v16.51,20.32 13.97,22.86 v13.97,30.48 | v21.59,45.72 24.13,48.26 29.92,48.26 30.45,47.73 38.84,47.73 v39.37,48.26
D2  (via drill 0.55)
  Top 0.406: U$11.17 33.02,16.51 36.58,20.07 36.58,38.94 v36.63,38.99
  Bottom 0.406: v36.63,38.99 37.01,39.37 U1.9
D3  (via drill 0.55)
  Top 0.406: U$11.6 19.68,24.77 19.68,34.92 20.32,35.56 20.32,38.99 v20.45,39.12
  Bottom 0.406: U1.10 43.18,36.83 42.04,37.97 27.3,37.97 26.16,39.12 v20.45,39.12
D6  (via drill 0.55)
  Top 0.406: U$11.19 33.02,21.59 34.67,23.24 34.67,25.02 33.02,26.67 v33.02,40.64 | v39.37,40.64 39.37,42.55 43.81,46.99 U1.6
  Bottom 0.406: v33.02,40.64 v39.37,40.64
D7  (via drill 0.55)
  Top 0.406: U$11.4 26.67,21.59 22.86,25.4 22.86,38.1 24.13,39.37 v30.23,39.37 | U1.7 43.18,44.45 v43.18,41.91
  Bottom 0.406: v30.23,39.37 32.77,41.91 v43.18,41.91
GND  (via drill 0.51)
  Top 0.406: v60.96,21.59 62.23,22.86 v62.23,26.67 | J27.1 86.36,26.29 v86.36,27.94 | v7.56,66.74 6.7,65.88 U$1.5.GND
  Bottom 0.203: U$3.2 15.24,53.34 8.89,53.34 7.62,54.61
  Bottom 0.406: U1.19 57.15,33.02 57.15,26.67 v62.23,26.67 | J29.1 60.96,20.95 v60.96,21.59 | v86.36,27.94 U$8.16
  pour Bottom (isolate 0.61): 0,0 100.33,0 100.33,100.33 0,100.33
MCLR
  Top 0.406: U1.1 U$4.1 29.21,66.04 R2.1 25.4,68.62 U$5.P$2
N$1
  Top 0.406: LED1.K 10.16,77.47 11.43,78.74 R1.2
N$2
  Top 0.406: U1.20 58.42,39.37 C3.+
N$3
  Top 0.406: LED2.K 98.17,32.64 R5.2
N$4  (via drill 0.55)
  Top 0.406: R6.1 66.08,78.02 U$9.P$2 66.08,71.16 66.04,71.12 v66.04,68.58
  Bottom 0.406: v66.04,68.58 66.04,63.75 71.37,58.42 U$8.1
N$5
  Top 0.406: J2.2 43.18,80.01 44.45,81.28 U$10.3
N$6
  Top 0.406: U$8.21 93.93,40.64 93.95,40.66 94.19,40.66 96.52,38.33 LED2.A
N$7
  Top 0.406: J2.1 43.18,77.47 44.45,78.74 U$10.4
N$8
  Top 0.406: J1.2 42.55,72.39 46.35,76.2 U$10.5
N$9
  Top 0.406: U$10.6 45.72,73.66 41.91,69.85 J1.1
N$10
  Top 0.406: U$11.9 J5.1
N$11
  Top 0.406: U$11.15 J4.1
N$12
  Top 0.406: J3.1 U$11.20
N$13
  Top 0.406: J6.1 U$8.2
N$14
  Top 0.406: J7.1 U$8.3
N$15
  Top 0.406: J8.1 U$8.4
N$16
  Top 0.406: J9.1 U$8.5
N$17
  Top 0.406: J10.1 U$8.6
N$18
  Top 0.406: J11.1 U$8.7
N$19
  Top 0.406: J12.1 U$8.8
N$20
  Bottom 0.406: U$8.26 89.38,53.34 82.55,60.17 J15.1
N$21
  Bottom 0.406: J14.1 87.63,57.15 88.9,55.88 U$8.27
N$22
  Bottom 0.406: J13.1 92.71,60.96 U$8.28
N$23
  Top 0.406: J16.8 J17.8 J18.8 J19.8 J20.8
N$24
  Top 0.406: J20.7 J19.7 J18.7 J17.7 J16.7
N$25
  Top 0.406: J16.6 J17.6 J18.6 J19.6 J20.6
N$26
  Top 0.406: J20.5 J19.5 J18.5 J17.5 J16.5
N$27
  Top 0.406: J16.4 J17.4 J18.4 J19.4 J20.4
N$28
  Top 0.406: J20.3 J19.3 J18.3 J17.3 J16.3
N$29
  Top 0.406: J16.2 J17.2 J18.2 J19.2 J20.2
N$30
  Top 0.406: J20.1 J19.1 J18.1 J17.1 J16.1
N$31
  Top 0.406: J25.1 J24.1 J23.1 J22.1 J21.1
N$32
  Top 0.406: J21.2 J22.2 J23.2 J24.2 J25.2
N$33
  Top 0.406: J25.3 J24.3 J23.3 J22.3 J21.3
N$34
  Top 0.406: J21.4 J22.4 J23.4 J24.4 J25.4
N$35
  Top 0.406: J25.5 J24.5 J23.5 J22.5 J21.5
N$36
  Top 0.406: J21.6 J22.6 J23.6 J24.6 J25.6
N$37
  Top 0.406: J25.7 J24.7 J23.7 J22.7 J21.7
N$38
  Top 0.406: J21.8 J22.8 J23.8 J24.8 J25.8
RCK
  Top 0.406: U$11.14 36.83,8.89 38.86,10.92 38.86,28.74 41.87,31.75 U1.12
RRST  (via drill 0.55)
  Top 0.406: U$11.12 41.91,3.81 52.07,13.97 52.07,21.59 50.67,22.99 50.67,37.72 v50.29,38.1
  Bottom 0.406: v50.29,38.1 50.29,41.4 50.8,41.91 U1.21
V+
  Top 0.406: U$2.3 4.95,45.59 BAT.2
VIN  (via drill 0.55 pad 0.55)
  Top 0.406: U$2.2 4.98,53.31 19.59,53.31 20.32,54.05 U$3.3 23.75,59.31 23.75,75.78 31.79,83.82 U$10.2 | v8.89,48.26 8.89,41.91 2.54,35.56 2.54,11.43 12.95,1.02 53.59,1.02 J28.8 J28.7 J28.6 J28.5 J28.4 J28.3 J28.2 J28.1
  Bottom 0.406: U$3.3 16.51,52.07 8.89,52.07 v8.89,48.26
VSY  (via drill 0.55)
  Top 0.406: U$11.3 25.88,24.13 24,26.01 24,37.47 24.64,38.1 v25.4,38.1
  Bottom 0.406: v25.4,38.1 26.49,37.01 34.9,37.01 37.62,34.29 U1.11
WR  (via drill 0.55)
  Top 0.406: U$11.10 21.59,6.35 13.97,13.97 13.97,25.91 18.54,30.48 18.54,36.7 v19.05,37.21
  Bottom 0.406: v19.05,37.21 22.86,37.21 24,36.07 34.29,36.07 43.69,26.67 U1.14
WRST  (via drill 0.55)
  Top 0.406: U1.22 52.51,44.45 51.41,43.35 51.41,25.23 53.9,22.74 53.9,11.2 53.34,10.64 v53.34,7.62 47.88,2.16 29.59,2.16 U$11.11

### Text on the board
tPlace: IAN KENNEDY | ME 433 | Motor A | Motor B | B | + | RESET | USER | A | + | 3.3V | VIN | GND | GND